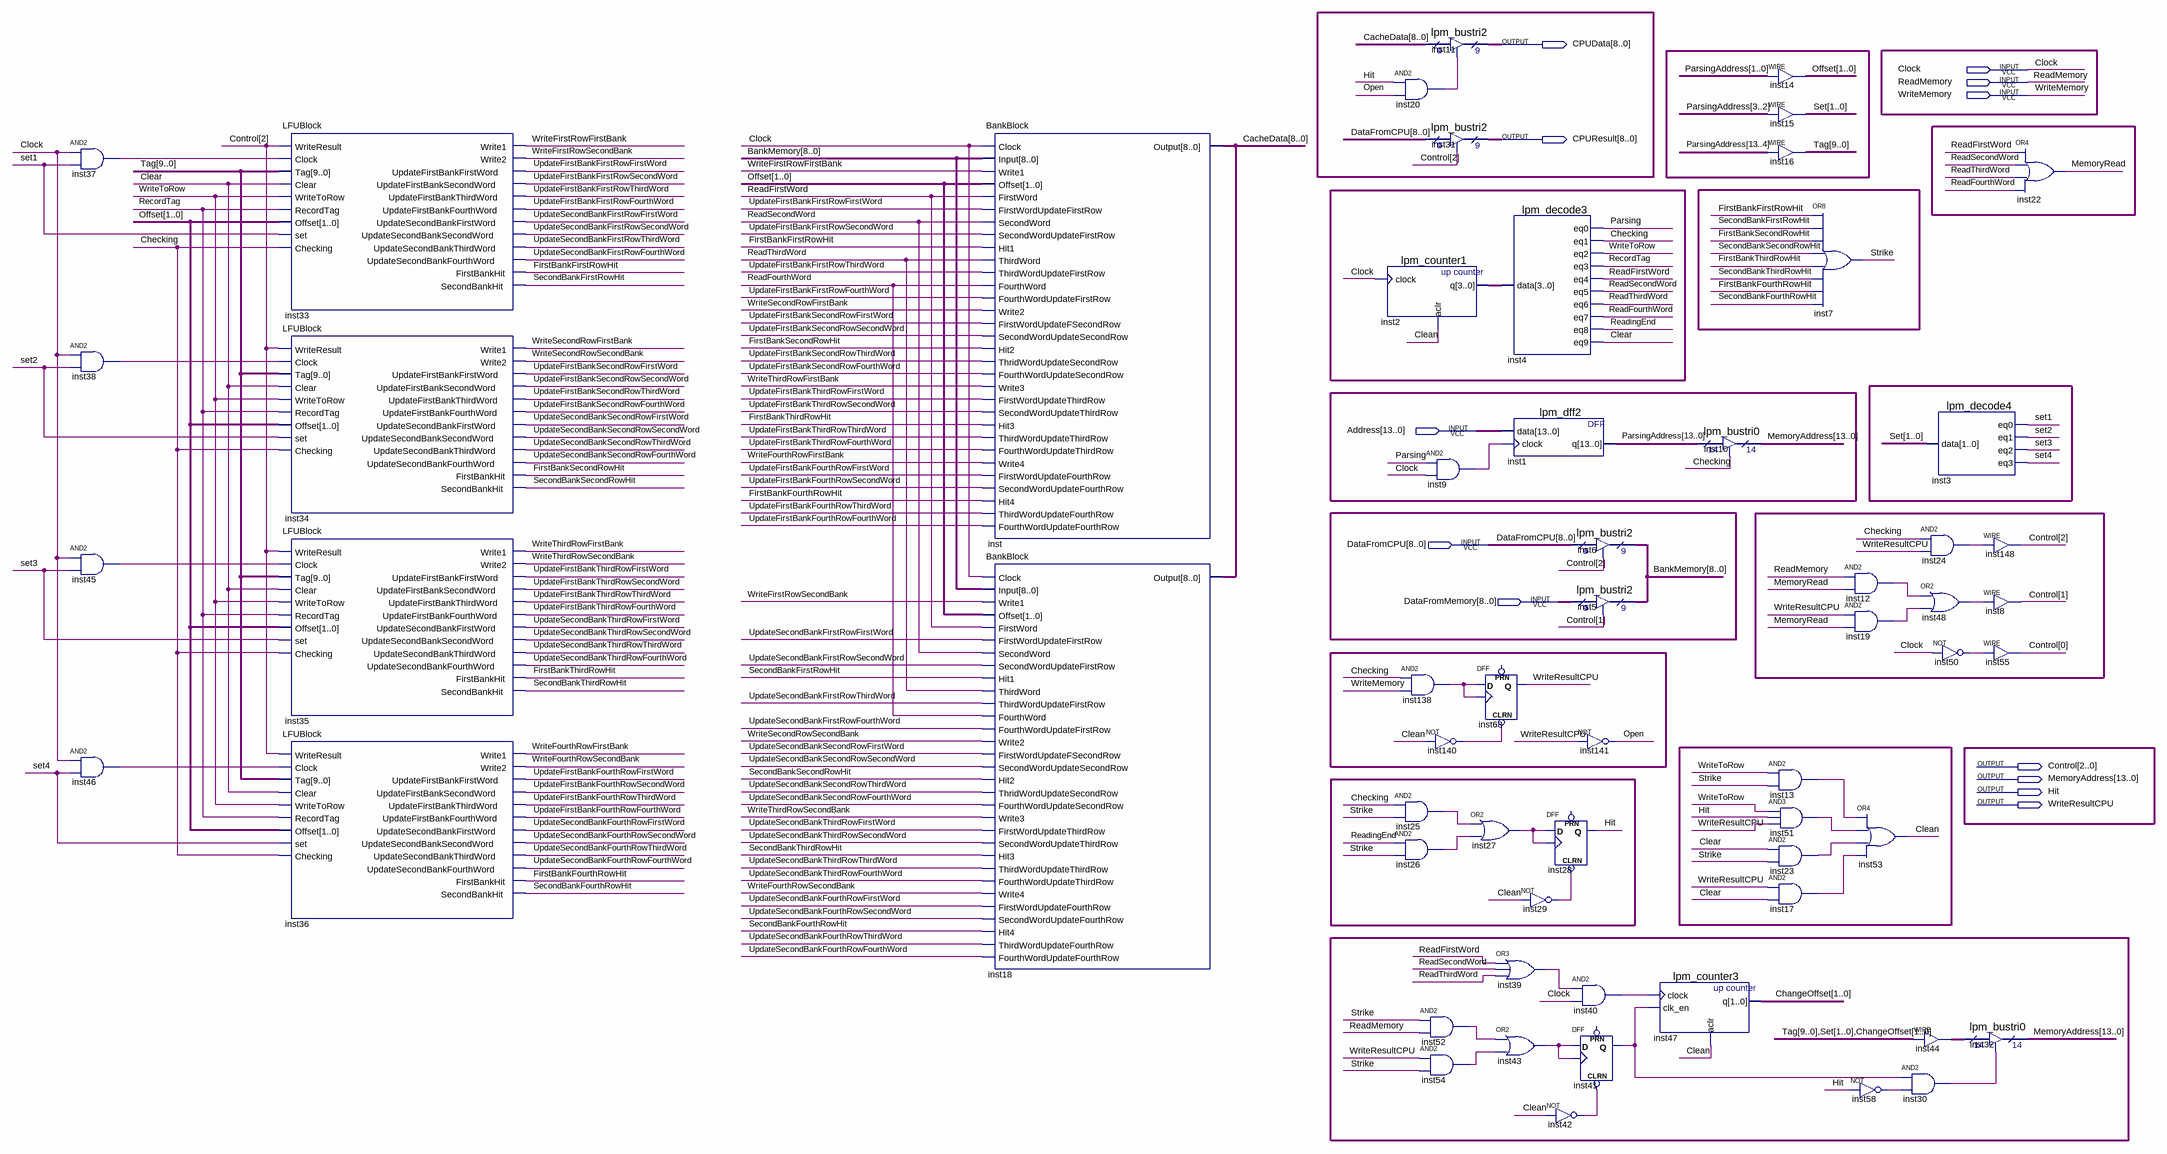
[diagram p0: schematic sheet]
// Quartus schematic CacheBlock.bdf as structural Verilog: 60 symbols, 12 pins
module CacheBlock (
  input  Clock,
  input  ReadMemory,
  input  WriteMemory,
  input  [13:0] Address,
  input  [8:0] DataFromCPU,
  input  [8:0] DataFromMemory,
  output [8:0] CPUData,
  output [8:0] CPUResult,
  output [2:0] Control,
  output [13:0] MemoryAddress,
  output Hit,
  output WriteResultCPU
);

  wire Checking, Clean, Clear, FirstBankFirstRowHit, FirstBankFourthRowHit, FirstBankSecondRowHit,
       FirstBankThirdRowHit, inst9_out, inst12_out, inst13_out, inst17_out, inst19_out, inst20_out,
       inst23_out, inst24_out, inst25_out, inst26_out, inst27_out, inst29_out, inst30_out, inst37_out,
       inst38_out, inst39_out, inst40_out, inst41_q, inst42_out, inst43_out, inst45_out, inst46_out,
       inst48_out, inst50_out, inst51_out, inst52_out, inst54_out, inst58_out, inst138_out, inst140_out,
       MemoryRead, Open, Parsing, ReadFirstWord, ReadFourthWord, ReadingEnd, ReadSecondWord, ReadThirdWord,
       RecordTag, SecondBankFirstRowHit, SecondBankFourthRowHit, SecondBankSecondRowHit,
       SecondBankThirdRowHit, set2, set3, set4, Strike, UpdateFirstBankFirstRowFirstWord,
       UpdateFirstBankFirstRowFourthWord, UpdateFirstBankFirstRowSecondWord,
       UpdateFirstBankFirstRowThirdWord, UpdateFirstBankFourthRowFirstWord,
       UpdateFirstBankFourthRowFourthWord, UpdateFirstBankFourthRowSecondWord,
       UpdateFirstBankFourthRowThirdWord, UpdateFirstBankSecondRowFirstWord,
       UpdateFirstBankSecondRowFourthWord, UpdateFirstBankSecondRowSecondWord,
       UpdateFirstBankSecondRowThirdWord, UpdateFirstBankThirdRowFirstWord,
       UpdateFirstBankThirdRowFourthWord, UpdateFirstBankThirdRowSecondWord,
       UpdateFirstBankThirdRowThirdWord, UpdateSecondBankFirstRowFirstWord,
       UpdateSecondBankFirstRowFourthWord, UpdateSecondBankFirstRowSecondWord,
       UpdateSecondBankFirstRowThirdWord, UpdateSecondBankFourthRowFirstWord,
       UpdateSecondBankFourthRowFourthWord, UpdateSecondBankFourthRowSecondWord,
       UpdateSecondBankFourthRowThirdWord, UpdateSecondBankSecondRowFirstWord,
       UpdateSecondBankSecondRowFourthWord, UpdateSecondBankSecondRowSecondWord,
       UpdateSecondBankSecondRowThirdWord, UpdateSecondBankThirdRowFirstWord,
       UpdateSecondBankThirdRowFourthWord, UpdateSecondBankThirdRowSecondWord,
       UpdateSecondBankThirdRowThirdWord, WriteFirstRowFirstBank, WriteFirstRowSecondBank,
       WriteFourthRowFirstBank, WriteFourthRowSecondBank, WriteSecondRowFirstBank, WriteSecondRowSecondBank,
       WriteThirdRowFirstBank, WriteThirdRowSecondBank, WriteToRow;
  wire [1:0] ChangeOffset, Offset, Set;
  wire [3:0] inst2_q;
  wire [8:0] BankMemory, CacheData;
  wire [9:0] Tag;
  wire [13:0] inst44_out, ParsingAddress;

  and inst37 (inst37_out, Clock, Set[1]);
  and inst38 (inst38_out, Clock, set2);
  and inst45 (inst45_out, Clock, set3);
  and inst46 (inst46_out, Clock, set4);
  LFUBlock inst33 (
    .WriteResult(Control[2]), .Clock(inst37_out), .Tag(Tag), .Clear(Clear), .WriteToRow(WriteToRow),
    .RecordTag(RecordTag), .Offset(Offset), .set(Set[1]), .Checking(Checking),
    .Write1(WriteFirstRowFirstBank), .Write2(WriteFirstRowSecondBank),
    .UpdateFirstBankFirstWord(UpdateFirstBankFirstRowFirstWord),
    .UpdateFirstBankSecondWord(UpdateFirstBankFirstRowSecondWord),
    .UpdateFirstBankThirdWord(UpdateFirstBankFirstRowThirdWord),
    .UpdateFirstBankFourthWord(UpdateFirstBankFirstRowFourthWord),
    .UpdateSecondBankFirstWord(UpdateSecondBankFirstRowFirstWord),
    .UpdateSecondBankSecondWord(UpdateSecondBankFirstRowSecondWord),
    .UpdateSecondBankThirdWord(UpdateSecondBankFirstRowThirdWord),
    .UpdateSecondBankFourthWord(UpdateSecondBankFirstRowFourthWord), .FirstBankHit(FirstBankFirstRowHit),
    .SecondBankHit(SecondBankFirstRowHit));
  LFUBlock inst34 (
    .WriteResult(Control[2]), .Clock(inst38_out), .Tag(Tag), .Clear(Clear), .WriteToRow(WriteToRow),
    .RecordTag(RecordTag), .Offset(Offset), .set(set2), .Checking(Checking),
    .Write1(WriteSecondRowFirstBank), .Write2(WriteSecondRowSecondBank),
    .UpdateFirstBankFirstWord(UpdateFirstBankSecondRowFirstWord),
    .UpdateFirstBankSecondWord(UpdateFirstBankSecondRowSecondWord),
    .UpdateFirstBankThirdWord(UpdateFirstBankSecondRowThirdWord),
    .UpdateFirstBankFourthWord(UpdateFirstBankSecondRowFourthWord),
    .UpdateSecondBankFirstWord(UpdateSecondBankSecondRowFirstWord),
    .UpdateSecondBankSecondWord(UpdateSecondBankSecondRowSecondWord),
    .UpdateSecondBankThirdWord(UpdateSecondBankSecondRowThirdWord),
    .UpdateSecondBankFourthWord(UpdateSecondBankSecondRowFourthWord), .FirstBankHit(FirstBankSecondRowHit),
    .SecondBankHit(SecondBankSecondRowHit));
  LFUBlock inst35 (
    .WriteResult(Control[2]), .Clock(inst45_out), .Tag(Tag), .Clear(Clear), .WriteToRow(WriteToRow),
    .RecordTag(RecordTag), .Offset(Offset), .set(set3), .Checking(Checking), .Write1(WriteThirdRowFirstBank),
    .Write2(WriteThirdRowSecondBank), .UpdateFirstBankFirstWord(UpdateFirstBankThirdRowFirstWord),
    .UpdateFirstBankSecondWord(UpdateFirstBankThirdRowSecondWord),
    .UpdateFirstBankThirdWord(UpdateFirstBankThirdRowThirdWord),
    .UpdateFirstBankFourthWord(UpdateFirstBankThirdRowFourthWord),
    .UpdateSecondBankFirstWord(UpdateSecondBankThirdRowFirstWord),
    .UpdateSecondBankSecondWord(UpdateSecondBankThirdRowSecondWord),
    .UpdateSecondBankThirdWord(UpdateSecondBankThirdRowThirdWord),
    .UpdateSecondBankFourthWord(UpdateSecondBankThirdRowFourthWord), .FirstBankHit(FirstBankThirdRowHit),
    .SecondBankHit(SecondBankThirdRowHit));
  LFUBlock inst36 (
    .WriteResult(Control[2]), .Clock(inst46_out), .Tag(Tag), .Clear(Clear), .WriteToRow(WriteToRow),
    .RecordTag(RecordTag), .Offset(Offset), .set(set4), .Checking(Checking),
    .Write1(WriteFourthRowFirstBank), .Write2(WriteFourthRowSecondBank),
    .UpdateFirstBankFirstWord(UpdateFirstBankFourthRowFirstWord),
    .UpdateFirstBankSecondWord(UpdateFirstBankFourthRowSecondWord),
    .UpdateFirstBankThirdWord(UpdateFirstBankFourthRowThirdWord),
    .UpdateFirstBankFourthWord(UpdateFirstBankFourthRowFourthWord),
    .UpdateSecondBankFirstWord(UpdateSecondBankFourthRowFirstWord),
    .UpdateSecondBankSecondWord(UpdateSecondBankFourthRowSecondWord),
    .UpdateSecondBankThirdWord(UpdateSecondBankFourthRowThirdWord),
    .UpdateSecondBankFourthWord(UpdateSecondBankFourthRowFourthWord), .FirstBankHit(FirstBankFourthRowHit),
    .SecondBankHit(SecondBankFourthRowHit));
  BankBlock inst (
    .Clock(Clock), .Input(BankMemory), .Write1(WriteFirstRowFirstBank), .Offset(Offset),
    .FirstWord(ReadFirstWord), .FirstWordUpdateFirstRow(UpdateFirstBankFirstRowFirstWord),
    .SecondWord(ReadSecondWord), .SecondWordUpdateFirstRow(UpdateFirstBankFirstRowSecondWord),
    .Hit1(FirstBankFirstRowHit), .ThirdWord(ReadThirdWord),
    .ThirdWordUpdateFirstRow(UpdateFirstBankFirstRowThirdWord), .FourthWord(ReadFourthWord),
    .FourthWordUpdateFirstRow(UpdateFirstBankFirstRowFourthWord), .Write2(WriteSecondRowFirstBank),
    .FirstWordUpdateFSecondRow(UpdateFirstBankSecondRowFirstWord),
    .SecondWordUpdateSecondRow(UpdateFirstBankSecondRowSecondWord), .Hit2(FirstBankSecondRowHit),
    .ThridWordUpdateSecondRow(UpdateFirstBankSecondRowThirdWord),
    .FourthWordUpdateSecondRow(UpdateFirstBankSecondRowFourthWord), .Write3(WriteThirdRowFirstBank),
    .FirstWordUpdateThirdRow(UpdateFirstBankThirdRowFirstWord),
    .SecondWordUpdateThirdRow(UpdateFirstBankThirdRowSecondWord), .Hit3(FirstBankThirdRowHit),
    .ThirdWordUpdateThirdRow(UpdateFirstBankThirdRowThirdWord),
    .FourthWordUpdateThirdRow(UpdateFirstBankThirdRowFourthWord), .Write4(WriteFourthRowFirstBank),
    .FirstWordUpdateFourthRow(UpdateFirstBankFourthRowFirstWord),
    .SecondWordUpdateFourthRow(UpdateFirstBankFourthRowSecondWord), .Hit4(FirstBankFourthRowHit),
    .ThirdWordUpdateFourthRow(UpdateFirstBankFourthRowThirdWord),
    .FourthWordUpdateFourthRow(UpdateFirstBankFourthRowFourthWord), .Output(CacheData));
  BankBlock inst18 (
    .Clock(Clock), .Input(BankMemory), .Write1(WriteFirstRowSecondBank), .Offset(Offset),
    .FirstWord(ReadFirstWord), .FirstWordUpdateFirstRow(UpdateSecondBankFirstRowFirstWord),
    .SecondWord(ReadSecondWord), .SecondWordUpdateFirstRow(UpdateSecondBankFirstRowSecondWord),
    .Hit1(SecondBankFirstRowHit), .ThirdWord(ReadThirdWord),
    .ThirdWordUpdateFirstRow(UpdateSecondBankFirstRowThirdWord), .FourthWord(ReadFourthWord),
    .FourthWordUpdateFirstRow(UpdateSecondBankFirstRowFourthWord), .Write2(WriteSecondRowSecondBank),
    .FirstWordUpdateFSecondRow(UpdateSecondBankSecondRowFirstWord),
    .SecondWordUpdateSecondRow(UpdateSecondBankSecondRowSecondWord), .Hit2(SecondBankSecondRowHit),
    .ThridWordUpdateSecondRow(UpdateSecondBankSecondRowThirdWord),
    .FourthWordUpdateSecondRow(UpdateSecondBankSecondRowFourthWord), .Write3(WriteThirdRowSecondBank),
    .FirstWordUpdateThirdRow(UpdateSecondBankThirdRowFirstWord),
    .SecondWordUpdateThirdRow(UpdateSecondBankThirdRowSecondWord), .Hit3(SecondBankThirdRowHit),
    .ThirdWordUpdateThirdRow(UpdateSecondBankThirdRowThirdWord),
    .FourthWordUpdateThirdRow(UpdateSecondBankThirdRowFourthWord), .Write4(WriteFourthRowSecondBank),
    .FirstWordUpdateFourthRow(UpdateSecondBankFourthRowFirstWord),
    .SecondWordUpdateFourthRow(UpdateSecondBankFourthRowSecondWord), .Hit4(SecondBankFourthRowHit),
    .ThirdWordUpdateFourthRow(UpdateSecondBankFourthRowThirdWord),
    .FourthWordUpdateFourthRow(UpdateSecondBankFourthRowFourthWord), .Output(CacheData));
  and inst20 (inst20_out, Hit, Open);
  lpm_counter1 inst2 (.clock(Clock), .aclr(Clean), .q(inst2_q));
  and inst138 (inst138_out, Checking, WriteMemory);
  and inst25 (inst25_out, Checking, Strike);
  and inst26 (inst26_out, ReadingEnd, Strike);
  lpm_bustri2 inst11 (.enabledt(inst20_out), .data(CacheData), .tridata(CPUData));
  lpm_bustri2 inst31 (.enabledt(Control[2]), .data(DataFromCPU), .tridata(CPUResult));
  and inst9 (inst9_out, Parsing, Clock);
  not inst140 (inst140_out, Clean);
  and inst52 (inst52_out, Strike, ReadMemory);
  and inst54 (inst54_out, WriteResultCPU, Strike);
  lpm_decode3 inst4 (
    .data(inst2_q), .eq0(Parsing), .eq1(Checking), .eq2(WriteToRow), .eq3(RecordTag), .eq4(ReadFirstWord),
    .eq5(ReadSecondWord), .eq6(ReadThirdWord), .eq7(ReadFourthWord), .eq8(ReadingEnd), .eq9(Clear));
  lpm_dff2 inst1 (.data(Address), .clock(inst9_out), .q(ParsingAddress));
  DFF inst68 (.CLRN(inst140_out), .CLK(inst138_out), .D(inst138_out), .Q(WriteResultCPU));  // open: PRN
  or inst27 (inst27_out, inst25_out, inst26_out);
  or inst39 (inst39_out, ReadFirstWord, ReadSecondWord, ReadThirdWord);
  or inst43 (inst43_out, inst52_out, inst54_out);
  DFF inst28 (.CLRN(inst29_out), .CLK(inst27_out), .D(inst27_out), .Q(Hit));  // open: PRN
  not inst29 (inst29_out, Clean);
  not inst42 (inst42_out, Clean);
  lpm_bustri2 inst6 (.enabledt(Control[2]), .data(DataFromCPU), .tridata(BankMemory));
  lpm_bustri2 inst5 (.enabledt(Control[1]), .data(DataFromMemory), .tridata(BankMemory));
  not inst141 (Open, WriteResultCPU);
  and inst40 (inst40_out, inst39_out, Clock);
  DFF inst41 (.CLRN(inst42_out), .CLK(inst43_out), .D(inst43_out), .Q(inst41_q));  // open: PRN
  lpm_counter3 inst47 (.clock(inst40_out), .clk_en(inst41_q), .aclr(Clean), .q(ChangeOffset));
  lpm_bustri0 inst10 (.enabledt(Checking), .data(ParsingAddress), .tridata(MemoryAddress));
  assign Offset = ParsingAddress[1:0];  // WIRE inst14
  assign Set = ParsingAddress[3:2];  // WIRE inst15
  assign Tag = ParsingAddress[13:4];  // WIRE inst16
  and inst13 (inst13_out, WriteToRow, Strike);
  and inst51 (inst51_out, WriteToRow, Hit, WriteResultCPU);
  and inst23 (inst23_out, Clear, Strike);
  and inst17 (inst17_out, WriteResultCPU, Clear);
  or inst7 (Strike, FirstBankFirstRowHit, SecondBankFirstRowHit, FirstBankSecondRowHit, SecondBankSecondRowHit, FirstBankThirdRowHit, SecondBankThirdRowHit, FirstBankFourthRowHit, SecondBankFourthRowHit);
  and inst12 (inst12_out, ReadMemory, MemoryRead);
  and inst19 (inst19_out, WriteResultCPU, MemoryRead);
  or inst53 (Clean, inst13_out, inst51_out, inst23_out, inst17_out);
  not inst58 (inst58_out, Hit);
  and inst24 (inst24_out, Checking, WriteResultCPU);
  or inst48 (inst48_out, inst12_out, inst19_out);
  assign inst44_out = {Tag, Set, ChangeOffset};  // WIRE inst44
  and inst30 (inst30_out, inst41_q, inst58_out);
  lpm_decode4 inst3 (.data(Set), .eq0(Set[1]), .eq1(set2), .eq2(set3), .eq3(set4));
  not inst50 (inst50_out, Clock);
  lpm_bustri0 inst32 (.enabledt(inst30_out), .data(inst44_out), .tridata(MemoryAddress));
  or inst22 (MemoryRead, ReadFirstWord, ReadSecondWord, ReadThirdWord, ReadFourthWord);
  assign Control[2] = inst24_out;  // WIRE inst148
  assign Control[1] = inst48_out;  // WIRE inst8
  assign Control[0] = inst50_out;  // WIRE inst55
endmodule
